# Altium schematic sheet SSR OUTPUTS.SchDoc
size A4; DocumentNumber: 9; SheetNumber: ALT0056; SheetTotal: 21
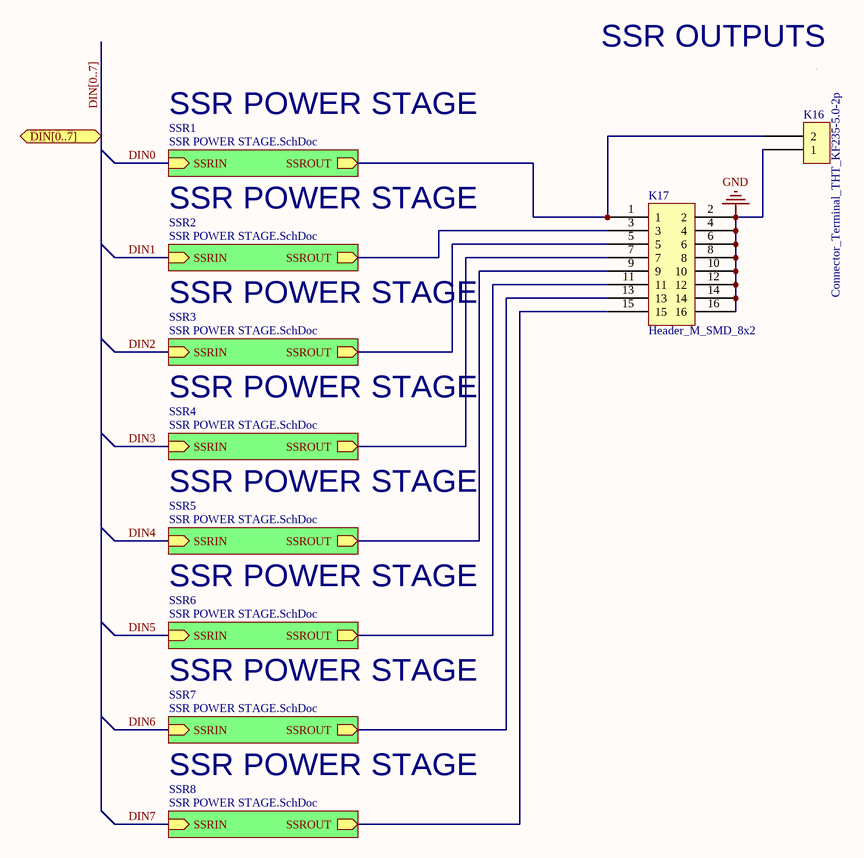
[diagram p0: SSR OUTPUTS.SchDoc]

## Parts
K16  Connector_Terminal_THT_KF235-5.0-2p  [KF235-5.0-2p]
K17  Header_M_SMD_8x2  [Header_Male_2.54 8x2]

## Sub-sheets
SSR1 = SSR POWER STAGE.SchDoc: SSROUT (out), SSRIN (in)
SSR2 = SSR POWER STAGE.SchDoc: SSROUT (out), SSRIN (in)
SSR3 = SSR POWER STAGE.SchDoc: SSROUT (out), SSRIN (in)
SSR4 = SSR POWER STAGE.SchDoc: SSROUT (out), SSRIN (in)
SSR5 = SSR POWER STAGE.SchDoc: SSROUT (out), SSRIN (in)
SSR6 = SSR POWER STAGE.SchDoc: SSROUT (out), SSRIN (in)
SSR7 = SSR POWER STAGE.SchDoc: SSROUT (out), SSRIN (in)
SSR8 = SSR POWER STAGE.SchDoc: SSROUT (out), SSRIN (in)

## Ports
DIN[0..7] (in)

## Nets
GND: K16.1 K17.2 K17.4 K17.6 K17.8 K17.10 K17.12 K17.14 K17.16
DIN0: sheet SSR1/SSRIN
DIN1: sheet SSR2/SSRIN
DIN2: sheet SSR3/SSRIN
DIN3: sheet SSR4/SSRIN
DIN4: sheet SSR5/SSRIN
DIN5: sheet SSR6/SSRIN
DIN6: sheet SSR7/SSRIN
DIN7: sheet SSR8/SSRIN
NetK16_2: K16.2 K17.1 ; sheet SSR1/SSROUT
NetK17_3: K17.3 ; sheet SSR2/SSROUT
NetK17_5: K17.5 ; sheet SSR3/SSROUT
NetK17_7: K17.7 ; sheet SSR4/SSROUT
NetK17_9: K17.9 ; sheet SSR5/SSROUT
NetK17_11: K17.11 ; sheet SSR6/SSROUT
NetK17_13: K17.13 ; sheet SSR7/SSROUT
NetK17_15: K17.15 ; sheet SSR8/SSROUT

## Buses and harness runs
bus DIN[0..7] = port DIN[0..7]

## Notes on the sheet
- SSR OUTPUTS
- SSR POWER STAGE
- Title
- Size:
- Date:
- A4
- Number:
- Time:
- Revision:
- Sheet
- of
- File:

## Library data of the parts
K17 = Header_M_SMD_8x2: SMD Header 8x2